# Altium schematic sheet Input_output_Connectors.SchDoc
size A4
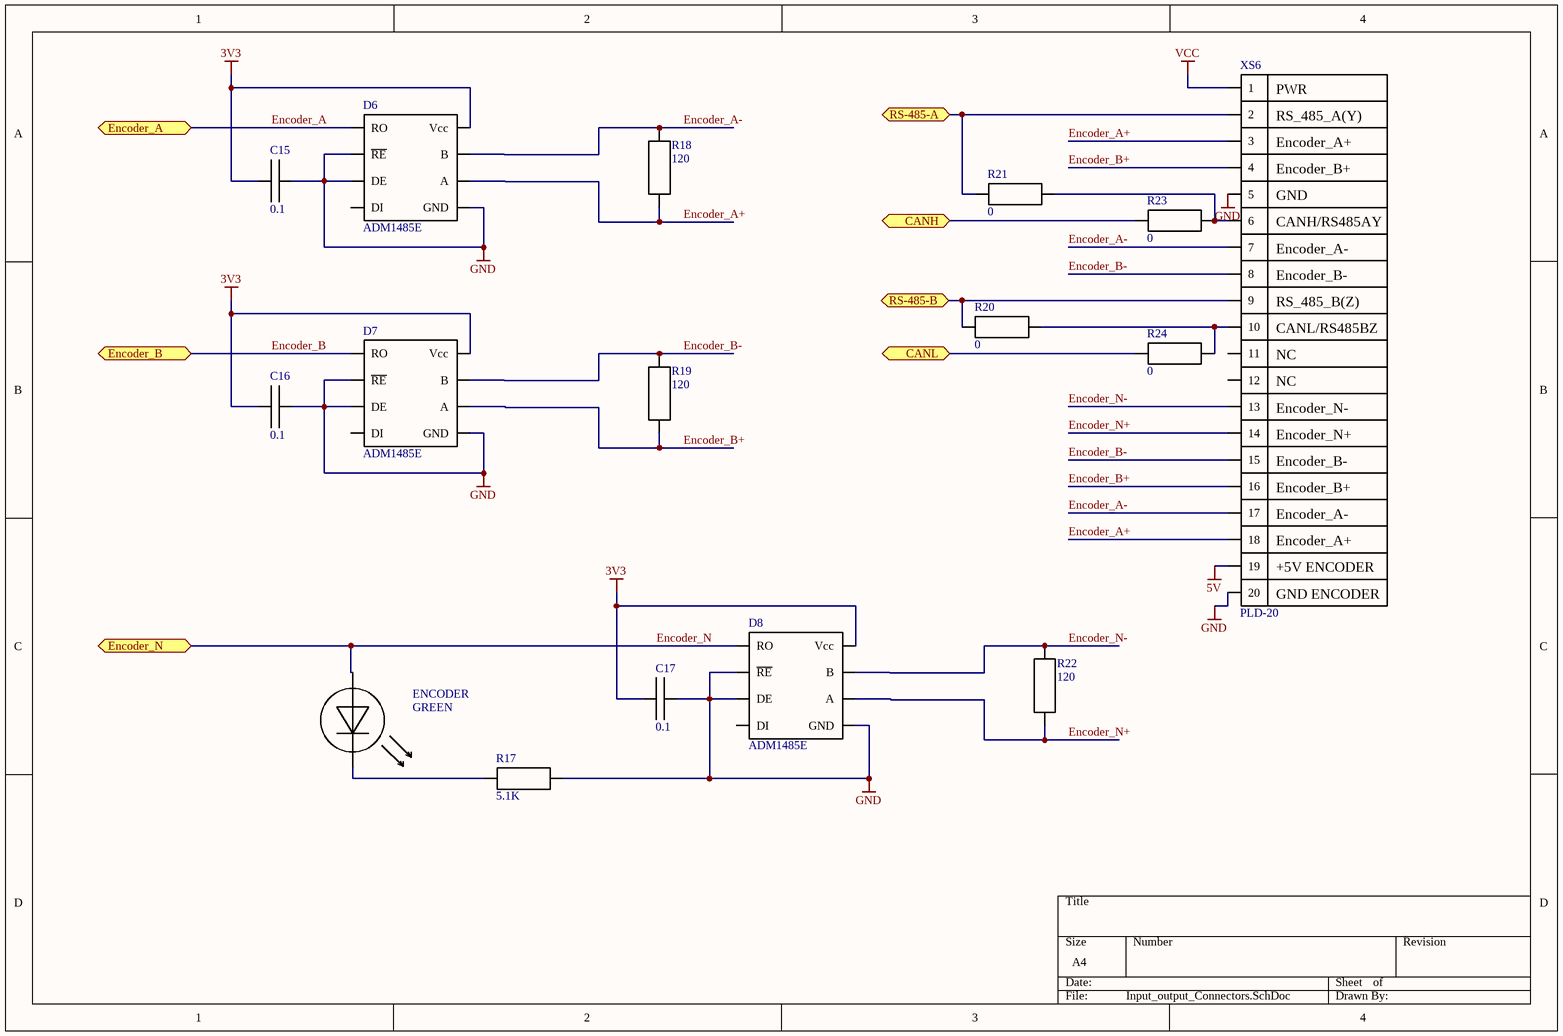
[diagram p0: Input_output_Connectors.SchDoc]

## Parts
C15  0.1  [SMD_0402_C]
C16  0.1  [SMD_0402_C]
C17  0.1  [SMD_0402_C]
D6  ADM1485E  [SOIC_N 8-Lead]
D7  ADM1485E  [SOIC_N 8-Lead]
D8  ADM1485E  [SOIC_N 8-Lead]
ENCODER  GREEN  [SMD_LED]
R17  5.1K  [SMD_0603]
R18  120  [SMD_0603]
R19  120  [SMD_0603]
R20  0  [SMD_0603]
R21  0  [SMD_0603]
R22  120  [SMD_0603]
R23  0  [SMD_0603]
R24  0  [SMD_0603]
XS6  PLD-20  [IDC2.54-20]

## Ports
CANH, CANL, Encoder_A, Encoder_B, Encoder_N, RS-485-A, RS-485-B

## Nets
3V3: C15.1 C16.1 C17.1 D6.8(Vcc) D7.8(Vcc) D8.8(Vcc)
5V: XS6.19
GND: C15.2 C16.2 C17.2 D6.2(~{RE}) D6.3(DE) D6.5(GND) D7.2(~{RE}) D7.3(DE) D7.5(GND) D8.2(~{RE}) D8.3(DE) D8.5(GND) R17.2 XS6.5 XS6.20
VCC: XS6.1
CANH: R23.1 ; port CANH
CANL: R24.1 ; port CANL
Encoder_A: D6.1(RO) ; port Encoder_A
Encoder_A+: D6.6(A) R18.1 XS6.3 XS6.18
Encoder_A-: D6.7(B) R18.2 XS6.7 XS6.17
Encoder_B: D7.1(RO) ; port Encoder_B
Encoder_B+: D7.6(A) R19.1 XS6.4 XS6.16
Encoder_B-: D7.7(B) R19.2 XS6.8 XS6.15
Encoder_N: D8.1(RO) ENCODER.2 ; port Encoder_N
Encoder_N+: D8.6(A) R22.1 XS6.14
Encoder_N-: D8.7(B) R22.2 XS6.13
RS-485-A: R21.1 XS6.2 ; port RS-485-A
RS-485-B: R20.1 XS6.9 ; port RS-485-B
NetENCODER_1: ENCODER.1 R17.1
NetR20_2: R20.2 R24.2 XS6.10
NetR21_2: R21.2 R23.2 XS6.6

Not connected (* = marked no-connect by the designer): D6 4(DI); D7 4(DI); D8 4(DI); XS6 11 12

## Notes on the sheet
- (in symbol PLD-20) PWR; RS_485_A(Y); Encoder_A+; Encoder_B+; GND; CANH/RS485AY; Encoder_A-; Encoder_B-; RS_485_B(Z); CANL/RS485BZ; NC; Encoder_N-; Encoder_N+; +5V ENCODER; GND ENCODER

## Library data of the parts
C15-C17 = Capacitor
D6-D8 = ADM1485
ENCODER = LED_Diode
R17-R19 R22 = Resistor: 0603 resistor
R20 R21 = Resistor: dont fitting
R23 R24 = Resistor
XS6 = PLD-20: HSOW2 encoder and external connector